# Altium schematic sheet Power_Driver_2.SchDoc
size 254 x 203 mm; Author: Aurimas Vilkas; DrawnBy: Aurimas Vilkas; Engineer: Aurimas Vilkas
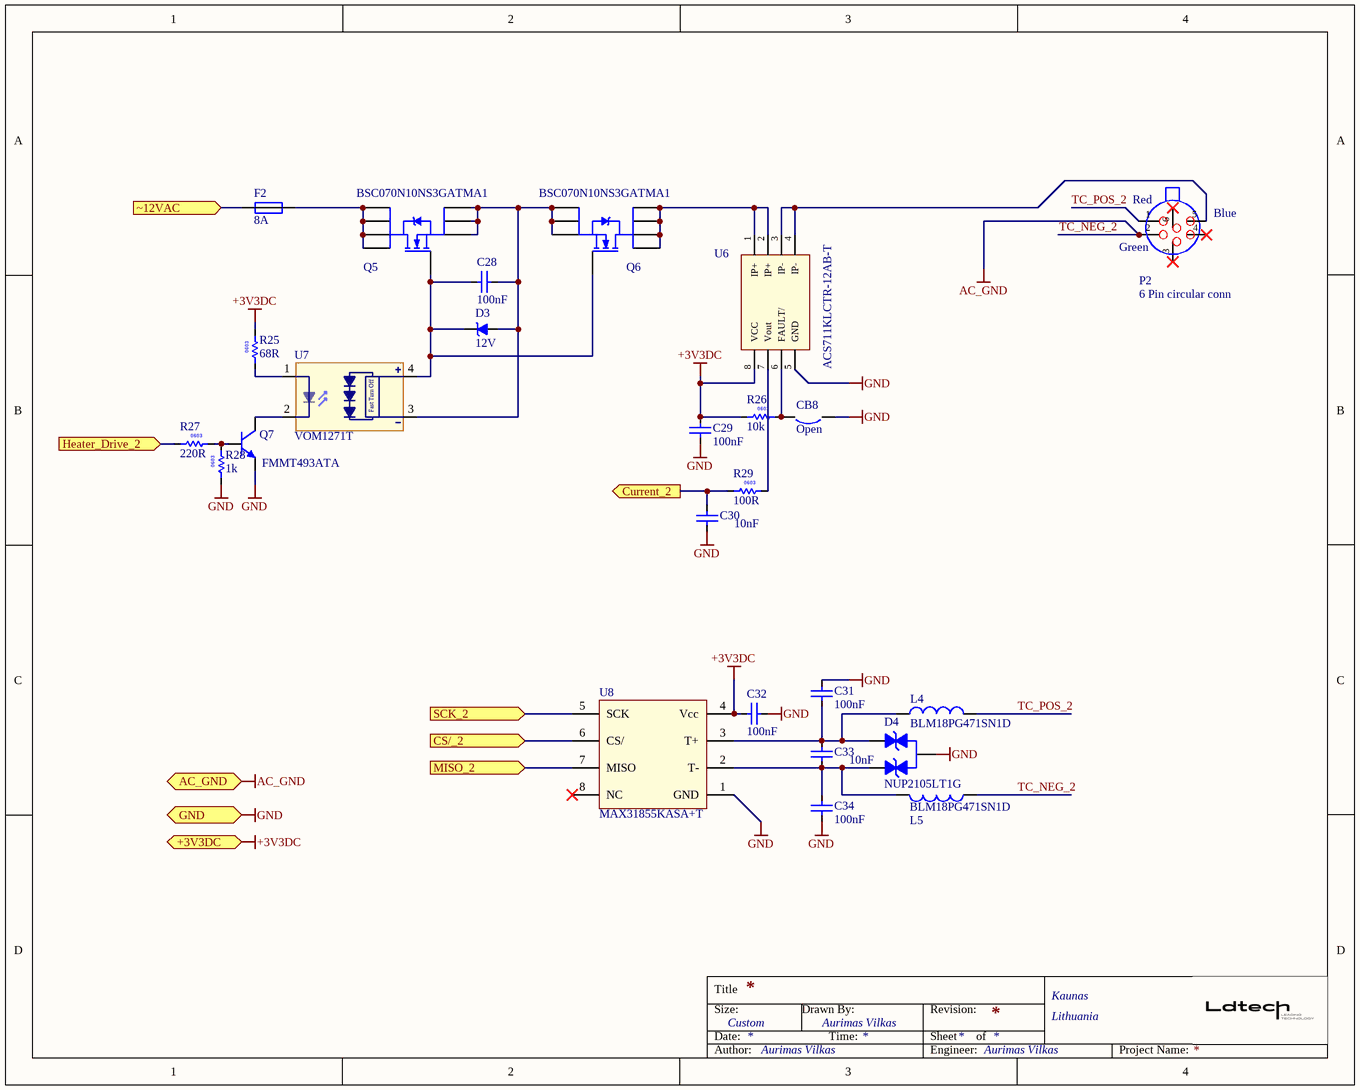
[diagram p0: Power_Driver_2.SchDoc]

## Parts
C28  100nF  [CAPC1608N]
C29  100nF  [CAPC1608N]
C30  10nF  [CAPC1608N]
C31  100nF  [CAPC1608N]
C32  100nF  [CAPC1608N]
C33  10nF  [CAPC1608N]
C34  100nF  [CAPC1608N]
CB8  Open  [CB_0603]
D3  12V  [SOD-80C]
D4  NUP2105LT1G  [SOT23-3]
F2  8A  [1206F]
L4  BLM18PG471SN1D  [LL0603\2P]
L5  BLM18PG471SN1D  [LL0603\2P]
P2  6 Pin circular conn  [RPC1-12RB-6P(71)]
Q5  BSC070N10NS3GATMA1  [PG-TDSON-8]
Q6  BSC070N10NS3GATMA1  [PG-TDSON-8]
Q7  FMMT493ATA  [SOT23-3]
R25  68R  [RESC1608N]
R26  10k  [RESC1608N]
R27  220R  [RESC1608N]
R28  1k  [RESC1608N]
R29  100R  [RESC1608N]
U6  ACS711KLCTR-12AB-T  [SOIC-8]
U7  VOM1271T  [SOP-4]
U8  MAX31855KASA+T  [SOIC-8]

## Ports
+3V3DC (in), AC_GND (in), CS/_2 (in), Current_2 (out), GND (in), Heater_Drive_2 (in), MISO_2 (in), SCK_2 (in), ~12VAC (in)

## Nets
+3V3DC: C29.2 C32.1 R25.2 R26.1 U6.8(VCC) U8.4(Vcc) ; port +3V3DC
GND: C29.1 C30.2 C31.2 C32.2 C34.1 CB8.1 D4.3 Q7.2(E) R28.1 U6.5(GND) U8.1(GND) ; port GND
TC_NEG_2: L5.1 P2.2 ; port AC_GND  [also labelled AC_GND]
CS/_2: U8.6(CS/) ; port CS/_2
Current_2: C30.1 R29.1 ; port Current_2
Heater_Drive_2: R27.1 ; port Heater_Drive_2
MISO_2: U8.7(MISO) ; port MISO_2
SCK_2: U8.5(SCK) ; port SCK_2
TC_POS_2: L4.2 P2.1
~12VAC: F2.2 ; port ~12VAC
NetC28_1: C28.1 D3.2(A) Q5.3(S) Q6.3(S) U7.3(K)
NetC28_2: C28.2 D3.1(K) Q5.1(G) Q6.1(G) U7.4(E)
NetC31_1: C31.1 C33.1 D4.2 L4.1 U8.3(T+)
NetC33_2: C33.2 C34.2 D4.1 L5.2 U8.2(T-)
NetCB8_2: CB8.2 R26.2 U6.6(FAULT/)
NetF2_1: F2.1 Q5.2(D)
NetP2_5: P2.5 U6.3(IP-) U6.4(IP-)
NetQ6_2: Q6.2(D) U6.1(IP+) U6.2(IP+)
NetQ7_1: Q7.1(B) R27.2 R28.2
NetQ7_3: Q7.3(C) U7.2(K)
NetR25_1: R25.1 U7.1(A)
NetR29_2: R29.2 U6.7(Vout)

Not connected (* = marked no-connect by the designer): P2 3* 4* 6*; U8 8(NC)*

## Notes on the sheet
- (near P2) Red
- (near P2) Blue
- (near P2) Green
- Title
- Size:
- Date:
- Custom
- Drawn By:
- Time:
- Revision:
- Sheet
- of
- Kaunas
- Lithuania
- Author:
- Engineer:
- Project Name:
- (in symbol R0000002) 0603
- (in symbol R0000008) 0603
- (in symbol R2406048) 0603
- (in symbol R2406056) 0603
- (in symbol VOM1271T) Fast Turn Off

## Library data of the parts
C28 C29 C31 C32 C34 = C0000005: MC0805B104K250CT -  SMD Multilayer Ceramic Capacitor, 0.1 µF, 25 V, 0805 [2012 Metric], ± 10%, X7R, MC Series; Supplier 1: Farnell; Supplier Part Number 1: 1759166
C30 C33 = C0000009: MCU0603R103KCT -  SMD Multilayer Ceramic Capacitor, 10000 pF, 50 V, 0603 [1608 Metric], ± 10%, X7R, MCU Series; Supplier 1: Farnell; Supplier Part Number 1: 9406182
CB8 = CB Open: Circuit Breaker; Revision: July-2002: Re-released for DXP Platform.
D3 = 12V: BZT55C12-GS08 -  Zener Single Diode, 12 V, 500 mW, SOD-80 (MiniMELF), 5 %, 2 Pins, 175 °C; Supplier 1: Farnell; Supplier Part Number 1: 2690028
D4 = NUP2105LT1G: NUP2105LT1G -  TVS Diode, NUP21 Series, Bidirectional, 22 V, 40 V, SOT-23, 3 Pins; Supplier Part number 1: 2101833; Supplier 1: Farnell
F2 = 8A Fuse: MCCFB1206TFF/8 -  Fuse, Surface Mount, 8 A, 32 V, Fast Acting, 1206; Supplier Part Number 1: 2850026; Supplier 1: Farnell
L4 L5 = L0000158: BLM18PG471SN1D -  Ferrite Bead, 0603 [1608 Metric], 470 ohm, 1 A, BLM18P Series, 0.2 ohm, ± 25%; Supplier 1: Farnell; Supplier Part Number 1: 1515745
P2 = RPC1-12RB-6P(71): RPC1-12RB-6P(71) -  Circular Connector, RP Series, Panel Mount Receptacle, 6 Contacts, Solder Pin; Supplier Part Number 1: 1077728; Supplier 1: Farnell
Q5 Q6 = BSC070N10NS3GATMA1: BSC070N10NS3GATMA1 -  Power MOSFET, N Channel, 100 V, 90 A, 0.0063 ohm, TDSON, Surface Mount; Kitron: 4084118; Supplier Part Number 1: 2443421; Supplier 1: Farnell
Q7 = FMMT493ATA: FMMT493ATA -  Bipolar (BJT) Single Transistor, NPN, 60 V, 150 MHz, 500 mW, 1 A, 300 hFE; Supplier Part Number 1: 2061448; Supplier 1: Farnell
R25 = R0000002: MCSR06X68R0FTL -  SMD Chip Resistor, 68 ohm, MCSR 06 Series, 75 V, Ceramic, 0603 [1608 Metric], 100 mW; Supplier 1: Farnell; Supplier Part Number 1: 2074301
R26 = R0000008: MCWR06X1002FTL -  SMD Chip Resistor, 0603 [1608 Metric], 10 kohm, MCWR Series, 50 V, Thick Film, 100 mW; Supplier 1: Farnell; Supplier Part Number 1: 2447230
R27 = R2406056: CRGH0603F220R -  SMD Chip Resistor, 220 ohm, CRG Series, 50 V, Thick Film, 0603 [1608 Metric], 200 mW; Supplier 1: Farnell; Supplier Part Number 1: 2331993
R28 = R2406056: CRGH0603F1K0 -  SMD Chip Resistor, 1 kohm, CRG Series, 50 V, Thick Film, 0603 [1608 Metric], 200 mW; Supplier 1: Farnell; Supplier Part Number 1: 2332003
R29 = R2406048: MCHVR03JTEX1000 -  SMD Chip Resistor, High Voltage, 100 ohm, HVR Series, 200 V, Thick Film, 0603 [1608 Metric], 100 mW; Supplier 1: Farnell; Supplier Part Number 1: 2825696
U6 = ACS711KLCTR-12AB-T: ACS711KLCTR-12AB-T -  Current Sensor, Overcurrent Fault, 4 mA, 100 kHz, SOIC, 8 Pins, 3 V, 5.5 V; Supplier Part Number 1: 2057423; Supplier 1: Farnell
U7 = VOM1271T: VOM1271T -  Photovoltaic MOSFET Driver, Integrated Fast Turn-Off, Solid-State Relay 47µA Out, 24 µs Delay, SOP-4; Supplier Part Number 1: 2395899; Supplier 1: Farnell
U8 = MAX31855KASA+T: MAX31855KASA+T -  Temperature Sensor IC, Thermocouple, Digital, ± 2°C, -200 °C, 1350 °C, NSOIC, 8 Pins; Supplier 1: Farnell; Supplier Part Number 1: 2515622